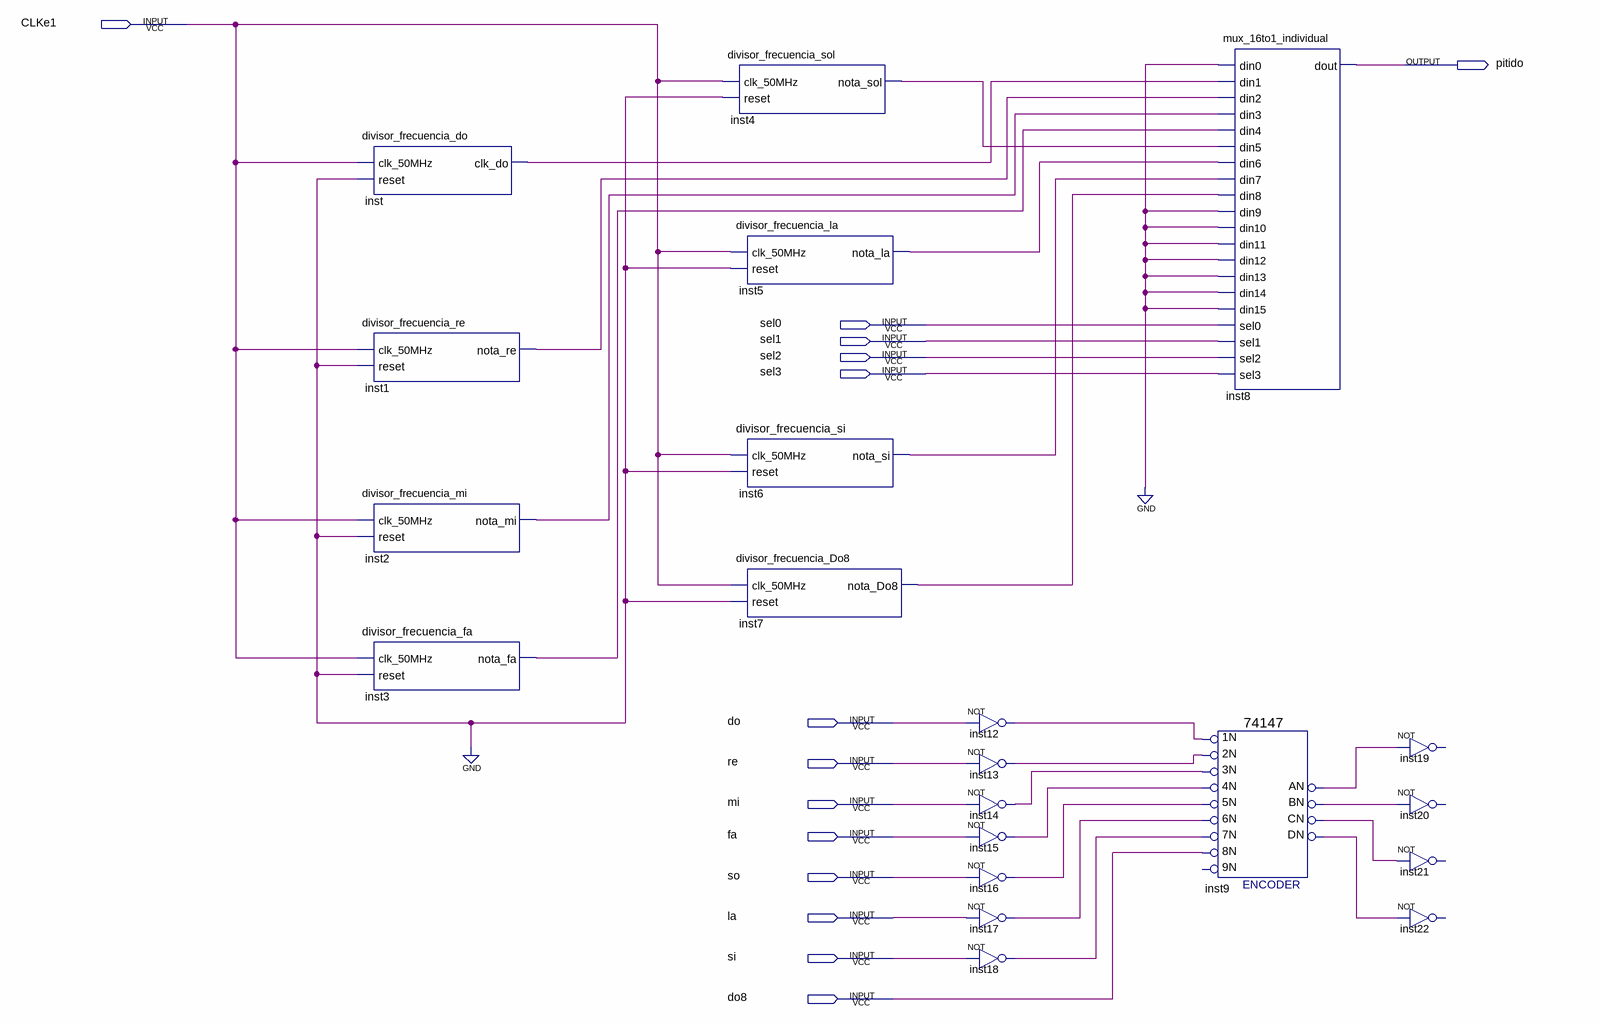
[diagram p0: schematic sheet]
// Quartus schematic pianito.bdf as structural Verilog: 21 symbols, 14 pins
module pianito (
  input  CLKe1,
  input  sel0,
  input  sel1,
  input  sel2,
  input  sel3,
  input  \do ,
  input  re,
  input  mi,
  input  fa,
  input  so,
  input  la,
  input  si,
  input  do8,
  output pitido
);

  wire inst1_nota_re, inst2_nota_mi, inst3_nota_fa, inst4_nota_sol, inst5_nota_la, inst6_nota_si,
       inst7_nota_do8, inst9_an, inst9_bn, inst9_cn, inst9_dn, inst12_out, inst13_out, inst14_out,
       inst15_out, inst16_out, inst17_out, inst18_out, inst_clk_do;

  divisor_frecuencia_do inst (.clk_50MHz(CLKe1), .reset(1'b0), .clk_do(inst_clk_do));
  divisor_frecuencia_re inst1 (.clk_50MHz(CLKe1), .reset(1'b0), .nota_re(inst1_nota_re));
  divisor_frecuencia_mi inst2 (.clk_50MHz(CLKe1), .reset(1'b0), .nota_mi(inst2_nota_mi));
  divisor_frecuencia_fa inst3 (.clk_50MHz(CLKe1), .reset(1'b0), .nota_fa(inst3_nota_fa));
  divisor_frecuencia_sol inst4 (.clk_50MHz(CLKe1), .reset(1'b0), .nota_sol(inst4_nota_sol));
  divisor_frecuencia_la inst5 (.clk_50MHz(CLKe1), .reset(1'b0), .nota_la(inst5_nota_la));
  divisor_frecuencia_si inst6 (.clk_50MHz(CLKe1), .reset(1'b0), .nota_si(inst6_nota_si));
  divisor_frecuencia_Do8 inst7 (.clk_50MHz(CLKe1), .reset(1'b0), .nota_Do8(inst7_nota_do8));
  not inst12 (inst12_out, \do );
  not inst13 (inst13_out, re);
  not inst14 (inst14_out, mi);
  not inst15 (inst15_out, fa);
  not inst16 (inst16_out, so);
  not inst17 (inst17_out, la);
  not inst18 (inst18_out, si);
  \74147  inst9 (
    .\1N (inst12_out), .\2N (inst13_out), .\3N (inst14_out), .\6N (inst17_out), .\5N (inst16_out),
    .\4N (inst15_out), .\8N (do8), .\7N (inst18_out), .CN(inst9_cn), .BN(inst9_bn), .AN(inst9_an),
    .DN(inst9_dn));  // open: 9N
  mux_16to1_individual inst8 (
    .din0(1'b0), .din1(inst_clk_do), .din2(inst1_nota_re), .din3(inst2_nota_mi), .din4(inst3_nota_fa),
    .din5(inst4_nota_sol), .din6(inst5_nota_la), .din7(inst6_nota_si), .din8(inst7_nota_do8), .din9(1'b0),
    .din10(1'b0), .din11(1'b0), .din12(1'b0), .din13(1'b0), .din14(1'b0), .din15(1'b0), .sel0(sel0),
    .sel1(sel1), .sel2(sel2), .sel3(sel3), .dout(pitido));
  // NOT inst19 has open pins: IN=inst9_an, OUT=open
  // NOT inst20 has open pins: IN=inst9_bn, OUT=open
  // NOT inst21 has open pins: IN=inst9_cn, OUT=open
  // NOT inst22 has open pins: IN=inst9_dn, OUT=open
endmodule
